# EAGLE schematic SMD_0603 (EAGLE 9.6.2)
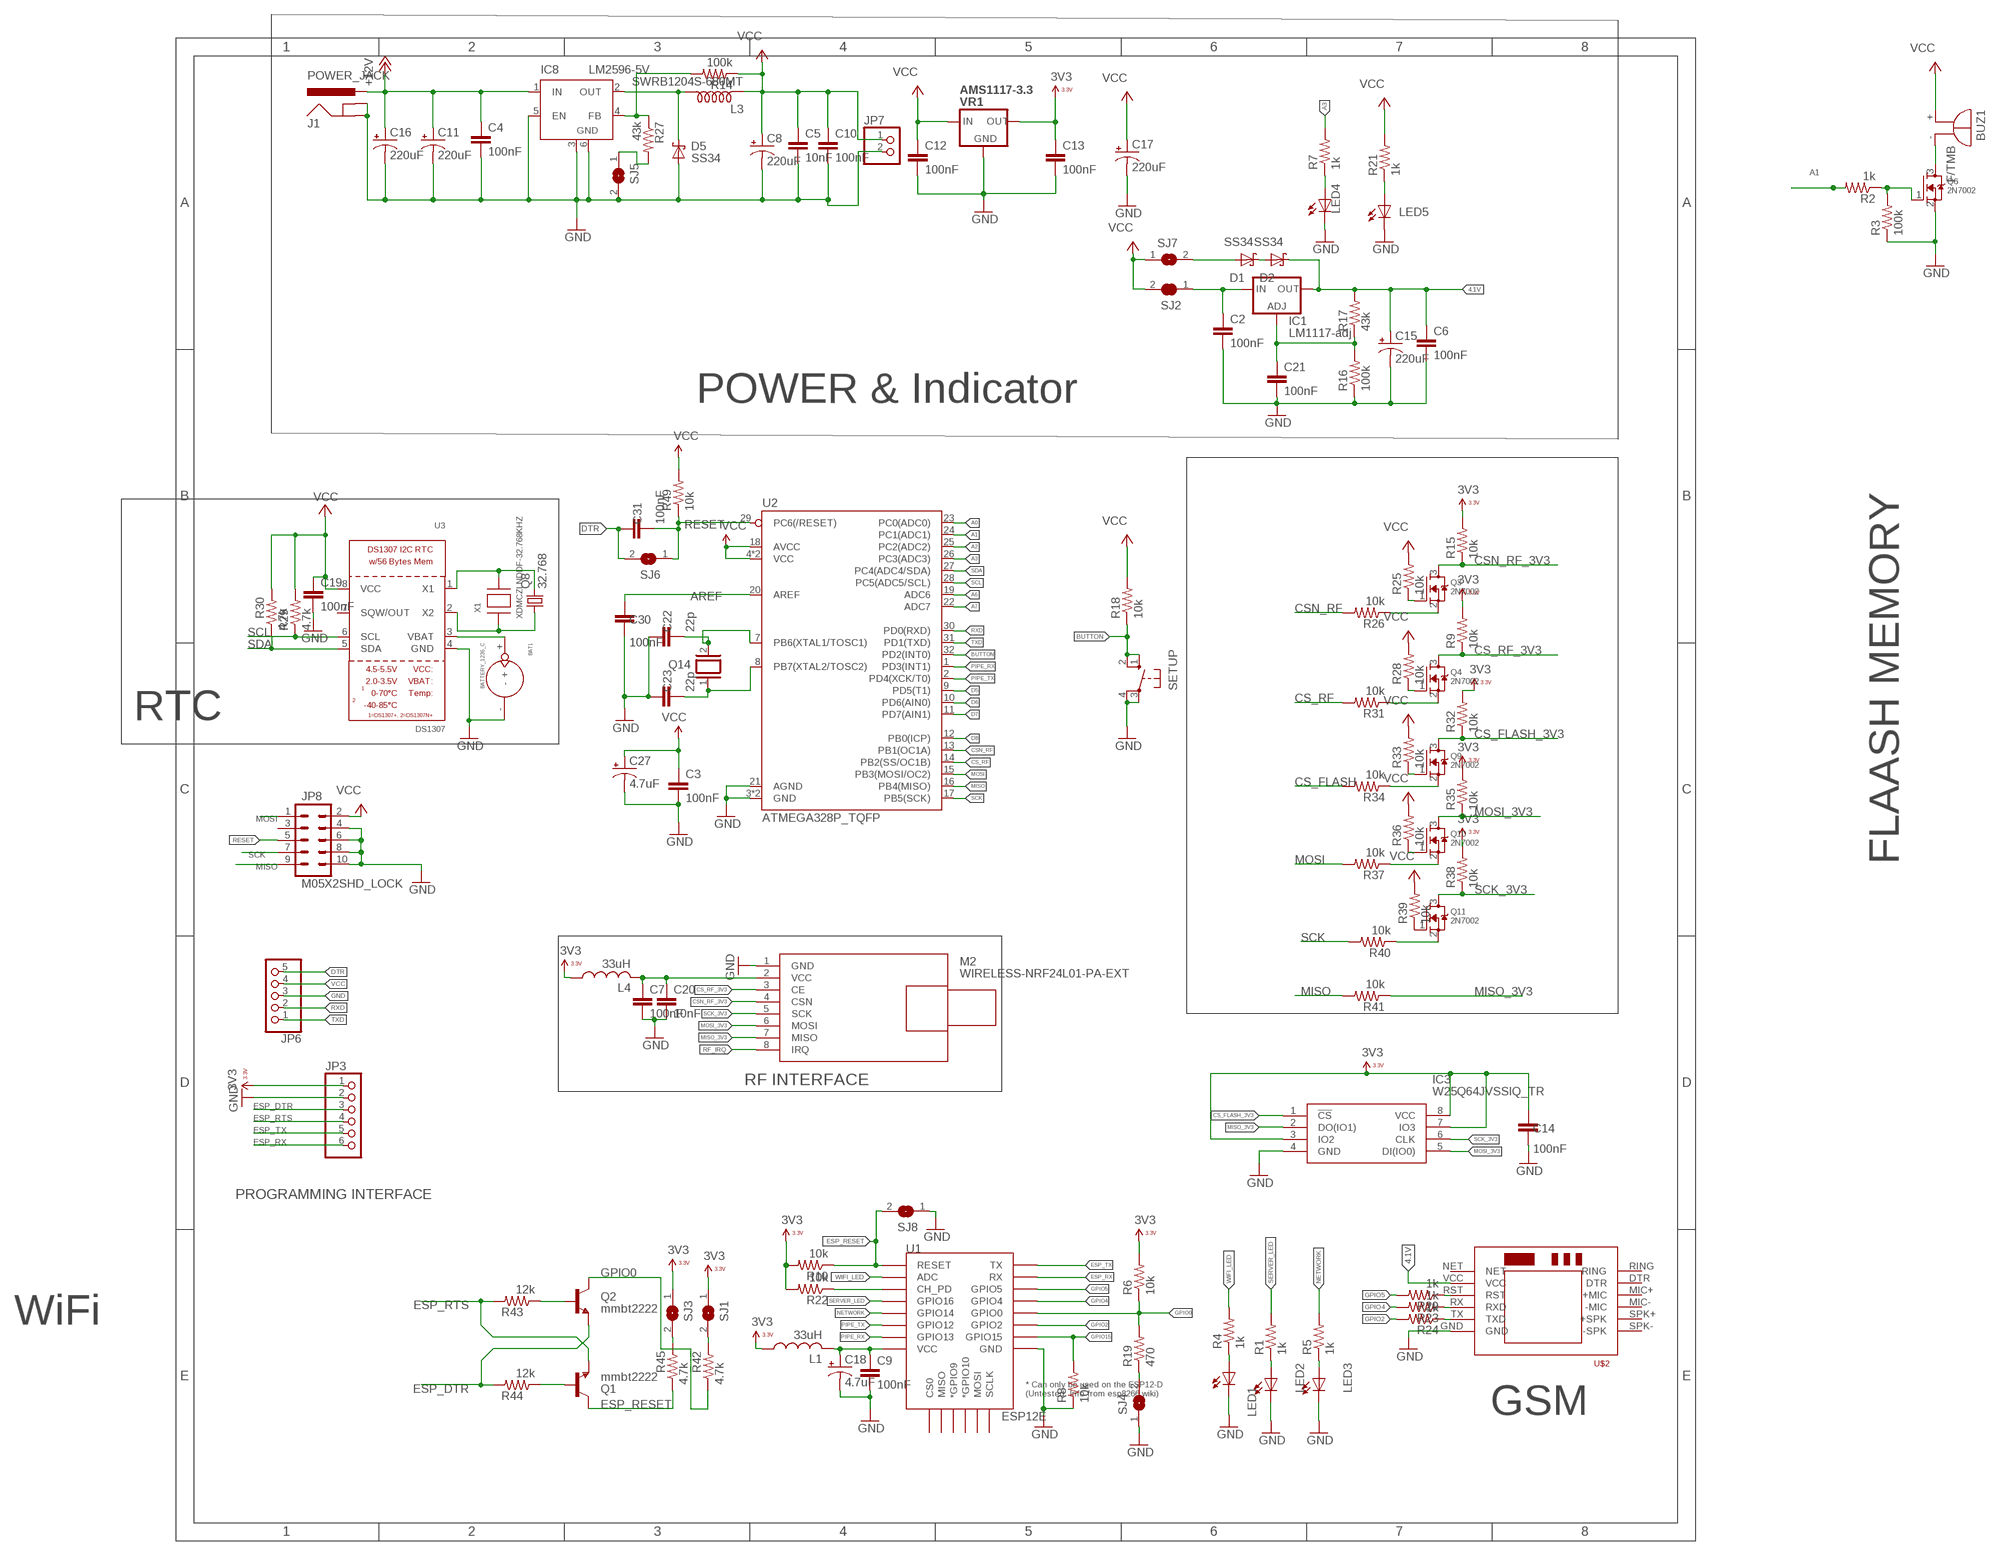
[diagram p0: schematic, sheet 1]

## Parts
BAT1  BATTERY_1236_C  [BATTERY_1236_C]
BUZ1  F/TMB  [F/TMB]
C2  100nF  C-EUC0603  [C0603]
C3  100nF  C-EUC0603  [C0603]
C4  100nF  C-EUC0603  [C0603]
C5  10nF  C-EUC0603  [C0603]
C6  100nF  C-EUC0603  [C0603]
C7  100nF  C-EUC0603  [C0603]
C8  220uF  CPOL-USUD-6,3X7,7  [UD-6,3X7,7_NICHICON]
C9  100nF  C-EUC0603  [C0603]
C10  100nF  C-EUC0603  [C0603]
C11  220uF  CPOL-USUD-6,3X7,7  [UD-6,3X7,7_NICHICON]
C12  100nF  C-EUC0603  [C0603]
C13  100nF  C-EUC0603  [C0603]
C14  100nF  C-EUC0603  [C0603]
C15  220uF  CPOL-USUD-6,3X7,7  [UD-6,3X7,7_NICHICON]
C16  220uF  CPOL-USUD-6,3X7,7  [UD-6,3X7,7_NICHICON]
C17  220uF  CPOL-USUD-6,3X7,7  [UD-6,3X7,7_NICHICON]
C18  4.7uF  100UF-POLAR-1206-6.3V-20%(TANT)  [1206-POLAR]
C19  100nF  C-EUC0603  [C0603]
C20  10nF  C-EUC0603  [C0603]
C21  100nF  C-EUC0603  [C0603]
C22  22p  C-EUC0603  [C0603]
C23  22p  C-EUC0603  [C0603]
C27  4.7uF  100UF-POLAR-1206-6.3V-20%(TANT)  [1206-POLAR]
C30  100nF  C-EUC0603  [C0603]
C31  100nF  C-EUC0603  [C0603]
D1  SS34  SCHOTTKY-DIODESMD  [SMB]
D2  SS34  SCHOTTKY-DIODESMD  [SMB]
D5  SS34  SCHOTTKY-DIODESMD  [SMB]
IC1  LM1117-adj  LD117AS25TR  [SOT223]
IC3  W25Q64JVSSIQ_TR  [SOIC127P790X216-8N]
IC8  LM2596-5V  LM2596S  [TO263-5]
J1  POWER_JACK  [POWER_JACK_PTH]
JP3  PINHD-1X6  [1X06]
JP6  PINHD-1X5  [1X05]
JP7  PINHD-1X2  [1X02]
JP8  M05X2SHD_LOCK  [2X5-SHROUDED_LOCK]
L1  33uH  L-USL0603  [L0603]
L3  SWRB1204S-680MT  A814AY-330M  [D10F]
L4  33uH  L-USL0603  [L0603]
LED1  LEDCHIPLED_0603  [CHIPLED_0603]
LED2  LEDCHIPLED_0603  [CHIPLED_0603]
LED3  LEDCHIPLED_0603  [CHIPLED_0603]
LED4  LEDCHIPLED_0603  [CHIPLED_0603]
LED5  LEDCHIPLED_0603  [CHIPLED_0603]
M2  WIRELESS-NRF24L01-PA-EXT  [WIRELESS-NRF24L01-PA-EXT]
Q1  mmbt2222  TRANSISTOR_NPNSOT23-3  [SOT23-3]
Q2  mmbt2222  TRANSISTOR_NPNSOT23-3  [SOT23-3]
Q3  2N7002  MOSFET-NREFLOW  [SOT23]
Q4  2N7002  MOSFET-NREFLOW  [SOT23]
Q6  2N7002  MOSFET-NREFLOW  [SOT23]
Q8  32.768  CRYTALSM49  [SM49@1]
Q9  2N7002  MOSFET-NREFLOW  [SOT23]
Q10  2N7002  MOSFET-NREFLOW  [SOT23]
Q11  2N7002  MOSFET-NREFLOW  [SOT23]
Q14  XTAL/S  [QS]
R1  1k  R-US_R0603  [R0603]
R2  1k  R-US_R0603  [R0603]
R3  100k  R-US_R0603  [R0603]
R4  1k  R-US_R0603  [R0603]
R5  1k  R-US_R0603  [R0603]
R6  10k  R-US_R0805  [R0805]
R7  1k  R-US_R0603  [R0603]
R8  10k  R-US_R0603  [R0603]
R9  10k  R-US_R0603  [R0603]
R10  10k  R-US_R0603  [R0603]
R14  100k  R-US_R0603  [R0603]
R15  10k  R-US_R0603  [R0603]
R16  100k  R-US_R0603  [R0603]
R17  43k  R-US_R0603  [R0603]
R18  10k  R-US_R0603  [R0603]
R19  470  R-US_R0805  [R0805]
R20  1k  R-US_R0603  [R0603]
R21  1k  R-US_R0603  [R0603]
R22  10k  R-US_R0603  [R0603]
R23  1k  R-US_R0603  [R0603]
R24  1k  R-US_R0603  [R0603]
R25  10k  R-US_R0603  [R0603]
R26  10k  R-US_R0603  [R0603]
R27  43k  R-US_R0603  [R0603]
R28  10k  R-US_R0603  [R0603]
R29  4.7k  R-US_R0603  [R0603]
R30  4.7k  R-US_R0603  [R0603]
R31  10k  R-US_R0603  [R0603]
R32  10k  R-US_R0603  [R0603]
R33  10k  R-US_R0603  [R0603]
R34  10k  R-US_R0603  [R0603]
R35  10k  R-US_R0603  [R0603]
R36  10k  R-US_R0603  [R0603]
R37  10k  R-US_R0603  [R0603]
R38  10k  R-US_R0603  [R0603]
R39  10k  R-US_R0603  [R0603]
R40  10k  R-US_R0603  [R0603]
R41  10k  R-US_R0603  [R0603]
R42  4.7k  R-US_R0603  [R0603]
R43  12k  R-US_R0603  [R0603]
R44  12k  R-US_R0603  [R0603]
R45  4.7k  R-US_R0603  [R0603]
R49  10k  R-US_R0603  [R0603]
SETUP  10-XX  [B3F-10XX]
SJ1  SJ  [SJ]
SJ2  SOLDERJUMPER_CLOSED  [SOLDERJUMPER_CLOSEDWIRE]
SJ3  SJ  [SJ]
SJ4  SJ  [SJ]
SJ5  SJ  [SJ]
SJ6  SJ  [SJ]
SJ7  SJ  [SJ]
SJ8  SJ  [SJ]
U1  ESP12E  ESP12ESMD  [ESP12E-SMD]
U2  ATMEGA328P_TQFP  [TQFP32-08]
U3  DS1307  RTC_DS1307  [SOIC8_150MIL]
U$2  SIM800LMODULE  [SIM800LMODULE]
VR1  AMS1117-3.3  NCP1117ST50T3G  [SOT223]
X1  XDMCZLNDDF-32.768KHZ  XTAL-3.2X1.5  [XTAL3215]

## Nets
3.3V: U2.4(VCC) U2.6(VCC) U2.18(AVCC) ; supply symbol labelled VCC
3V3: C13.1 C14.2 IC3.3(IO2) IC3.7(IO3) IC3.8(VCC) JP3.1 L1.1 L4.1 R6.2 R9.2 R10.2 R15.2 R22.2 R32.2 R35.2 R38.2 SJ1.1 SJ3.1 VR1.2(OUT) VR1.4(OUT)
4.1V: C6.1 C15.+ D2.C IC1.4(OUT) R17.2 U$2.VCC
+12V: C4.1 C11.+ C16.+ IC8.1(IN) J1.PWR
A0: U2.23(PC0(ADC0))
A1: R2.2 U2.24(PC1(ADC1))
A2: U2.25(PC2(ADC2))
A3: R7.2 U2.26(PC3(ADC3))
A6: U2.19(ADC6)
A7: U2.22(ADC7)
AREF: C30.2 U2.20(AREF)
BUTTON: R18.1 SETUP.1(S) SETUP.2(S1) U2.32(PD2(INT0))
CS_FLASH: R34.2
CS_FLASH_3V3: IC3.1(!CS) Q9.3(D) R32.1
CS_RF: R31.2 U2.14(PB2(SS/OC1B))
CS_RF_3V3: M2.3(CE) Q4.3(D) R9.1
CSN_RF: R26.2 U2.13(PB1(OC1A))
CSN_RF_3V3: M2.4(CSN) Q3.3(D) R15.1
D5: U2.9(PD5(T1))
D6: U2.10(PD6(AIN0))
D7: U2.11(PD7(AIN1))
D8: U2.12(PB0(ICP))
DTR: C31.2 JP6.5 SJ6.2
ESP_DTR: JP3.3 Q2.2(E) R44.2
ESP_RESET: Q1.3(C) R10.1 R45.1 SJ8.2 U1.RESET
ESP_RTS: JP3.4 Q1.2(E) R43.2
ESP_RX: JP3.6 U1.RXD0(RX)
ESP_TX: JP3.5 U1.TXD0(TX)
GND: BAT1.- C2.2 C3.2 C4.2 C5.2 C6.2 C7.2 C8.- C9.2 C10.2 C11.- C12.2 C13.2 C14.1 C15.- C16.- C17.- C18.2(-) C19.2 C20.2 C21.2 C22.2 C23.2 C27.2(-) C30.1 D5.A IC3.4(GND) IC8.3(GND) IC8.5(EN) IC8.6(GND) J1.GND J1.GNDBREAK JP3.2 JP6.3 JP7.2 JP8.4 JP8.6 JP8.8 JP8.10 LED1.C LED2.C LED3.C LED4.C LED5.C M2.1(GND) Q6.2(S) R3.1 R8.1 R16.1 SETUP.3(P) SETUP.4(P1) SJ4.1 SJ5.2 SJ8.1 U1.GND U2.3(GND) U2.5(GND) U2.21(AGND) U3.4(GND) U$2.GND VR1.1(GND)
GPIO0: Q2.3(C) R6.1 R19.2 R42.1 U1.GPIO0
GPIO2: R24.2 U1.GPIO2
GPIO4: R23.2 U1.GPIO4
GPIO5: R20.2 U1.GPIO5
GPIO15: R8.2 U1.GPIO15
MISO: JP8.9 R41.2 U2.16(PB4(MISO))
MISO_3V3: IC3.2(DO(IO1)) M2.7(MISO) R41.1
MOSI: JP8.1 R37.2 U2.15(PB3(MOSI/OC2))
MOSI_3V3: IC3.5(DI(IO0)) M2.6(MOSI) Q10.3(D) R35.1
N$1: D1.C D2.A
N$2: C2.1 IC1.3(IN) SJ2.1
N$3: D1.A SJ7.2
N$4: Q1.1(B) R44.1
N$6: D5.C IC8.2(OUT) L3.2
N$7: Q6.1(G) R2.1 R3.2
N$8: Q2.1(B) R43.1
N$9: Q3.1(G) R25.1
N$10: R22.1 U1.CH_PD
N$11: Q3.2(S) R26.1
N$12: LED2.A R1.1
N$13: C22.1 Q14.2 U2.7(PB6(XTAL1/TOSC1))
N$15: LED3.A R5.1
N$16: Q8.2 U3.1(X1) X1.P$2
N$20: BUZ1.- Q6.3(D)
N$21: R19.1 SJ4.2
N$23: IC8.4(FB) R14.2 R27.1
N$24: Q8.1 U3.2(X2) X1.P$1
N$25: LED4.A R7.1
N$26: R27.2 SJ5.1
N$27: R20.1 U$2.RST
N$28: BAT1.+ U3.3(VBAT)
N$29: Q4.1(G) R28.1
N$30: LED1.A R4.1
N$31: Q4.2(S) R31.1
N$32: C23.1 Q14.1 U2.8(PB7(XTAL2/TOSC2))
N$35: C7.1 C20.1 L4.2 M2.2(VCC)
N$36: LED5.A R21.1
N$37: Q9.1(G) R33.1
N$38: Q9.2(S) R34.1
N$40: R42.2 SJ1.2
N$41: Q10.1(G) R36.1
N$42: Q10.2(S) R37.1
N$43: R45.2 SJ3.2
N$44: R23.1 U$2.RX(RXD)
N$45: Q11.1(G) R39.1
N$46: R24.1 U$2.TX(TXD)
N$47: Q11.2(S) R40.1
N$48: C21.1 IC1.1(ADJ) R16.2 R17.1
NETWORK: R5.2 U1.GPIO14
PIPE_RX: U1.GPIO13 U2.1(PD3(INT1))
PIPE_TX: U1.GPIO12 U2.2(PD4(XCK/T0))
RESET: C31.1 JP8.5 R49.1 SJ6.1 U2.29(PC6(/RESET))
RF_IRQ: M2.8(IRQ)
RXD: JP6.2 U2.30(PD0(RXD))
SCK: JP8.7 R40.2 U2.17(PB5(SCK))
SCK_3V3: IC3.6(CLK) M2.5(SCK) Q11.3(D) R38.1
SCL: R29.1 U2.28(PC5(ADC5/SCL)) U3.6(SCL)
SDA: R30.1 U2.27(PC4(ADC4/SDA)) U3.5(SDA)
SDDSDSD: C9.1 C18.1(+) L1.2 U1.VCC
SERVER_LED: R1.2 U1.GPIO16
TXD: JP6.1 U2.31(PD1(TXD))
VCC: BUZ1.+ C3.1 C5.1 C8.+ C10.1 C12.1 C17.+ C19.1 C27.1(+) JP6.4 JP7.1 JP8.2 L3.1 R14.1 R18.2 R21.2 R25.2 R28.2 R29.2 R30.2 R33.2 R36.2 R39.2 R49.2 SJ2.2 SJ7.1 U3.8(VCC) VR1.3(IN)
WIFI_LED: R4.2 U1.ADC
Unconnected: JP8.3 U1.CS0 U1.GPIO9(*GPIO9) U1.GPIO10(*GPIO10) U1.MISO U1.MOSI U1.SCLK U3.7(SQW/OUT) U$2.DTR U$2.MIC+(+MIC) U$2.MIC-(-MIC) U$2.NET U$2.RING U$2.SPK+(+SPK) U$2.SPK-(-SPK)

## Notes on the sheet
- POWER & Indicator
- RTC
- FLAASH MEMORY
- RF INTERFACE
- PROGRAMMING INTERFACE
- WiFi
- GSM

## Library data of the parts
BAT1 = Itead_BP_110825.lbr:BATTERY_1236_C: SOC004
BUZ1 = buzzer:F/TMB: BUZZER Source: Buerklin; OC_FARNELL: unknown; OC_NEWARK: unknown
C2-C7 C9 C10 C12-C14 C19-C23 C30 C31 = rcl:C-EU: CAPACITOR, European symbol
C8 C11 C15-C17 = rcl:CPOL-US: POLARIZED CAPACITOR, American symbol
C18 C27 = SparkFun-Capacitors:100UF-POLAR: 100µF polarized capacitors A capacitor is a passive two-terminal electrical component used to store electrical energy temporarily in an electric field.; PROD_ID: CAP-14093; VALUE: 100uF
D1 D2 D5 = diode:SCHOTTKY-DIODE: Schottky Diode
IC1 = v-reg:LD117A?*: Low drop fixed and adjustable positive voltage regulators 1 A Source: http://www.st.com/stonline/products/literature/ds/7194/ld1117axx.pdf
IC3 = SamacSys_Parts:W25Q64JVSSIQ_TR: NOR Flash spiFlash, 64M-bit, DTR, 4Kb Uniform Sector Source: Datasheet <http://www.winbond.com/resource-files/w25q64jv spi revg 12142016.pdf>; DESCRIPTION: NOR Flash spiFlash, 64M-bit, DTR, 4Kb Uniform Sector; HEIGHT: 2.16mm; MANUFACTURER_NAME: Winbond; MANUFACTURER_PART_NUMBER: W25Q64JVSSIQ TR; MOUSER_PART_NUMBER: 454-W25Q64JVSSIQTR; MOUSER_PRICE-STOCK: https://www.mouser.co.uk/ProductDetail/Winbond/W25Q64JVSSIQ-TR?qs=qSfuJ%252Bfl%2Fd6FZTXsjBFnrA%3D%3D
IC8 = linear:LM2596S: STEP-DOWN VOLTAGE REGULATOR
J1 = SparkFun-Connectors:POWER_JACK: Power Jack Connector This is the standard 5.5mm barrel jack for power. The PTH is the most common, proven, reliable, footprint. The Slot footprint only works if the mill layer is transmitted to the PCB fab house so be warned. Here are the connectors we sell at SparkFun: DC Barrel Power Jack/Connector <https://www.sparkfun.com/products/119> (PRT-00119) DC Barrel Power Jack/Connector (SMD) <https://www.sparkfun.com/products/12748> (PRT-12748) DC Barrel Jack Adapter - Breadboard Compatible <https://www.sparkfun.com/products/10811> (PRT-10811) It is used on this SparkFun product (and many, many others): SparkFun RedBoard - Programmed with Arduino <https://www.sparkfun.com/products/12757> (DEV-12757) Also, if you need a mating power supply or connector, please check these out: Wall Adapter Power Supply - 9VDC 650mA <https://www.sparkfun.com/products/298> (TOL-00298) DC Barrel Jack Adapter - Male <https://www.sparkfun.com/products/10287> (PRT-10287); PROD_ID: CONN-08197
JP3 = pinhead:PINHD-1X6: PIN HEADER
JP6 = pinhead:PINHD-1X5: PIN HEADER
JP7 = pinhead:PINHD-1X2: PIN HEADER
JP8 = SparkFun-Connectors:M05X2: Header 5x2 Standard 10-pin dual row 0.1" header. Commonly used with AVR-ISP. Use with Spark Fun Electronics SKU: PRT-00778
L1 L4 = rcl-2:L-US: INDUCTOR, American symbol
L3 = inductor-toko:A814AY-330M: SMD 33µF Inductor Toko 1.72A 0.095ohm
LED1-LED5 = led:LED: LED OSRAM: - CHIPLED LG R971, LG N971, LY N971, LG Q971, LY Q971, LO R971, LY R971 LH N974, LH R974 LS Q976, LO Q976, LY Q976 LO Q996 - Hyper CHIPLED LW Q18S LB Q993, LB Q99A, LB R99A - SideLED LS A670, LO A670, LY A670, LG A670, LP A670 LB A673, LV A673, LT A673, LW A673 LH A674 LY A675 LS A676, LA A676, LO A676, LY A676, LW A676 LS A679, LY A679, LG A679 - Hyper Micro SIDELED® LS Y876, LA Y876, LO Y876, LY Y876 LT Y87S - SmartLED LW L88C, LW L88S LB L89C, LB L89S, LG L890 LS L89K, LO L89K, LY L89K LS L896, LA L896, LO L896, LY L896 - TOPLED LS T670, LO T670, LY T670, LG T670, LP T670 LSG T670, LSP T670, LSY T670, LOP T670, LYG T670 LG T671, LOG T671, LSG T671 LB T673, LV T673, LT T673, LW T673 LH T674 LS T676, LA T676, LO T676, LY T676, LB T676, LH T676, LSB T676, LW T676 LB T67C, LV T67C, LT T67C, LS T67K, LO T67K, LY T67K, LW E67C LS E67B, LA E67B, LO E67B, LY E67B, LB E67C, LV E67C, LT E67C LW T67C LS T679, LY T679, LG T679 LS T770, LO T770, LY T770, LG T770, LP T770 LB T773, LV T773, LT T773, LW T773 LH T774 LS E675, LA E675, LY E675, LS T675 LS T776, LA T776, LO T776, LY T776, LB T776 LHGB T686 LT T68C, LB T68C - Hyper Mini TOPLED® LB M676 - Mini TOPLED Santana® LG M470 LS M47K, LO M47K, LY M47K Source: http://www.osram.convergy.de LUXEON: - LUMILED® LXK2-PW12-R00, LXK2-PW12-S00, LXK2-PW14-U00, LXK2-PW14-V00 LXK2-PM12-R00, LXK2-PM12-S00, LXK2-PM14-U00 LXK2-PE12-Q00, LXK2-PE12-R00, LXK2-PE12-S00, LXK2-PE14-T00, LXK2-PE14-U00 LXK2-PB12-K00, LXK2-PB12-L00, LXK2-PB12-M00, LXK2-PB14-N00, LXK2-PB14-P00, LXK2-PB14-Q00 LXK2-PR12-L00, LXK2-PR12-M00, LXK2-PR14-Q00, LXK2-PR14-R00 LXK2-PD12-Q00, LXK2-PD12-R00, LXK2-PD12-S00 LXK2-PH12-R00, LXK2-PH12-S00 LXK2-PL12-P00, LXK2-PL12-Q00, LXK2-PL12-R00 Source: www.luxeon.com KINGBRIGHT: KA-3528ASYC Source: www.kingbright.com
M2 = diy-modules:WIRELESS-NRF24L01-PA-EXT: 2.4 GHz Wireless Module based on NRF24L01 chip with preamplifier and external antenna Click here to find device on ebay.com <http://www.ebay.com/sch/nrf24l01+pa+lna+sma>
Q1 Q2 = SparkFun:TRANSISTOR_NPN: Transistor NPN BJT configuration in SOT23 package. MMBT2222 is the common NPN we use. Double check BCE configuration again layout.
Q3 Q4 Q6 Q9-Q11 = adafruit:MOSFET-N: N-Channel Mosfet 2N7002E - 60V 260mA SOT23 [Digikey: 2N7002ET1GOSTR-ND] - REEL BSH103 - 30V 850mA SOT23 [Digikey: 568-5013-1-ND]
Q8 = crystal:CRYTAL: CRYSTAL
Q14 = special:XTAL/S: CRYSTAL
R1-R10 R14-R45 = resistor:R-US_: RESISTOR, American symbol
R49 = rcl:R-US_: RESISTOR, American symbol
SETUP = switch-omron:10-XX: OMRON SWITCH; MPN: B3F-1000; OC_FARNELL: 176432; OC_NEWARK: 36M3542
SJ1 SJ3-SJ8 = jumper:SJ: SMD solder JUMPER
SJ2 = microbuilder:SOLDERJUMPER_CLOSED: Solder Jumper - Closed These solder jumpers are closed by default CLOSEDWIRE - 10 mil trace between pads that can be cut and resoldered later CLOSEDPERM - 63 mil trace between pads for a permanent connection (used to 'bridge' two signals, a shameless hack for Eagle). Can double as a test point as well (no cream layer)
U1 = PatternAgents_RFmodules:ESP12E: ESP12E Module
U2 = SparkFun-IC-Microcontroller:ATMEGA328P_TQFP: Popular 328P in QFP Storefront component: ATmega328 - TQFP <https://www.sparkfun.com/products/13448> (COM-13448) Datasheet <http://www.sparkfun.com/datasheets/Components/SMD/ATMega328.pdf> SparkFun Products SparkFun RedBoard - Programmed with Arduino <https://www.sparkfun.com/products/12757> (DEV-12757) Arduino Pro Mini 328 - 5V/16MHz <https://www.sparkfun.com/products/11113> (DEV-11113) Arduino Pro Mini 328 - 3.3V/8MHz <https://www.sparkfun.com/products/11114> (DEV-11114) SparkFun OpenLog <https://www.sparkfun.com/products/13712> (DEV-13712) SparkFun MicroView - OLED Arduino Module <https://www.sparkfun.com/products/12923> (DEV-12923) SparkFun Digital Sandbox <https://www.sparkfun.com/products/12651> (DEV-12651) SparkFun PicoBoard <https://www.sparkfun.com/products/11888> (WIG-11888) Arduino Fio <https://www.sparkfun.com/products/10116> (DEV-10116) LilyPad Arduino 328 Main Board <https://www.sparkfun.com/products/13342> (DEV-13342) SparkFun RedStick <https://www.sparkfun.com/products/13741> (DEV-13741) LilyPad MP3 <https://www.sparkfun.com/products/11013> (DEV-11013) LilyPad Arduino SimpleSnap <https://www.sparkfun.com/products/10941> (DEV-10941) SparkFun Stepoko <https://www.sparkfun.com/products/13899> (ROB-13899) SparkFun Geiger Counter <https://www.sparkfun.com/products/11345> (SEN-11345) SparkFun EL Sequencer <https://www.sparkfun.com/products/12781> (COM-12781) Arduino Pro 328 - 5V/16MHz <https://www.sparkfun.com/products/10915> (DEV-10915) CryptoCape <https://www.sparkfun.com/products/12773> (DEV-12773) SparkFun IR Thermometer Evaluation Board - MLX90614 <https://www.sparkfun.com/products/10740> (SEN-10740) SparkFun RedBot Mainboard <https://www.sparkfun.com/products/12097> (ROB-12097) Arduino Pro 328 - 3.3V/8MHz <https://www.sparkfun.com/products/10914> (DEV-10914) SparkFun Block for Intel® Edison - Arduino <https://www.sparkfun.com/products/13036> (DEV-13036) SparkFun Simon Says - Surface Mount Soldering Kit <https://www.sparkfun.com/products/10935> (KIT-10935) SparkFun 7-Segment Serial Display - Red <https://www.sparkfun.com/products/11441> (COM-11441) SparkFun 7-Segment Serial Display - White <https://www.sparkfun.com/products/11629> (COM-11629) SparkFun 7-Segment Serial Display - Yellow <https://www.sparkfun.com/products/11443> (COM-11443) SparkFun 7-Segment Serial Display - Kelly Green <https://www.sparkfun.com/products/11440> (COM-11440) SparkFun 7-Segment Serial Display - Blue <https://www.sparkfun.com/products/11442> (COM-11442) SparkFun OpenSegment Serial Display - 20mm (Blue) <https://www.sparkfun.com/products/11647> (COM-11647) SparkFun OpenSegment Serial Display - 20mm (Green) <https://www.sparkfun.com/products/11646> (COM-11646) SparkFun OpenSegment Serial Display - 20mm (White) <https://www.sparkfun.com/products/11648> (COM-11648) SparkFun OpenSegment Serial Display - 20mm (Red) <https://www.sparkfun.com/products/11644> (COM-11644) SparkFun OpenSegment Serial Display - 20mm (Yellow) <https://www.sparkfun.com/products/11645> (COM-11645) SparkFun OpenSegment Shield <https://www.sparkfun.com/products/13190> (DEV-13190); PROD_ID: IC-09069
U3 = microbuilder:RTC_DS1307: DS1307 I2C RTC with 56-Bytes RAM
U$2 = SIM800LMODULE:SIM800LMODULE: SIM800L Module
VR1 = PatternAgents-OnSemi:NCP1117ST50T3G: NCP1117ST50T3G - 3 Terminal 5.0V LDO
X1 = adafruit:XTAL: Low cost SMT crystals, no capacitors included http://www.ladyada.net/library/eagle

## Net classes
1 vcc: width 0.254 mm